# Altium schematic sheet ROOM_MICRO.SchDoc
size 297 x 209 mm
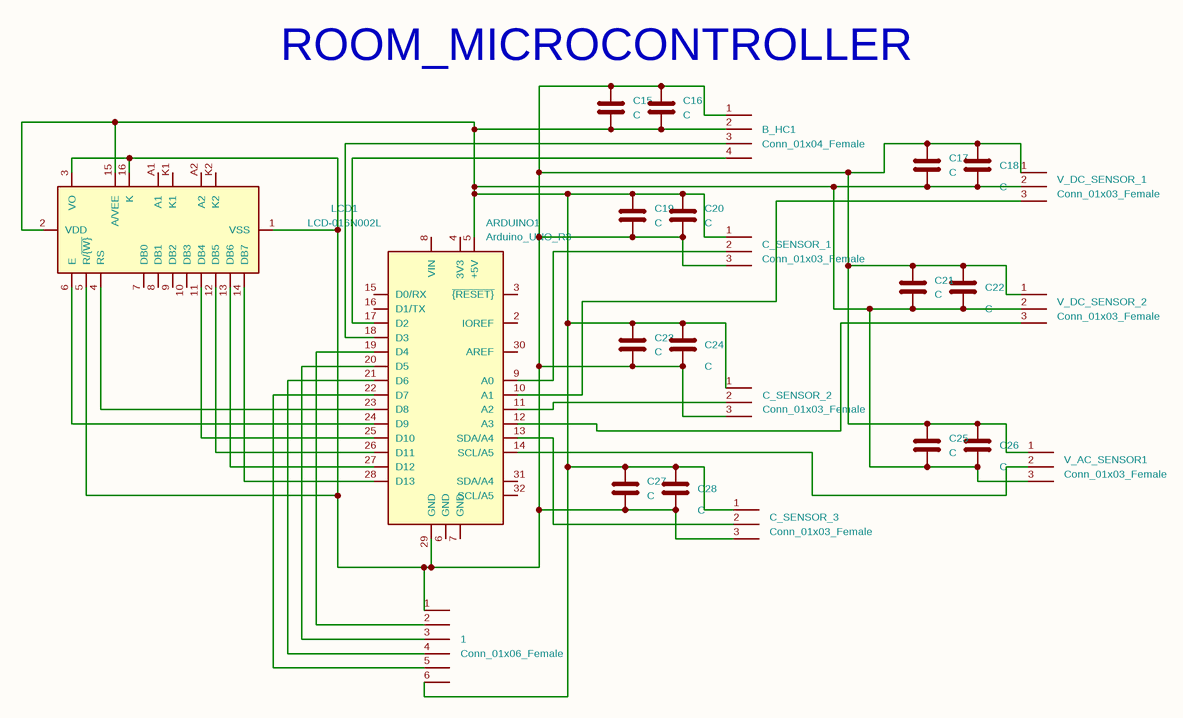
[diagram p0: ROOM_MICRO.SchDoc]

## Parts
1  Conn_01x06_Female  [PinHeader_1x06_P2.54mm_Vertical]
ARDUINO1  Arduino_UNO_R3  [Arduino_UNO_R3]
B_HC1  Conn_01x04_Female  [PinHeader_1x04_P2.54mm_Vertical]
C15  C  [C_0805_2012Metric]
C16  C  [C_0805_2012Metric]
C17  C  [C_0805_2012Metric]
C18  C  [C_0805_2012Metric]
C19  C  [C_0805_2012Metric]
C20  C  [C_0805_2012Metric]
C21  C  [C_0805_2012Metric]
C22  C  [C_0805_2012Metric]
C23  C  [C_0805_2012Metric]
C24  C  [C_0805_2012Metric]
C25  C  [C_0805_2012Metric]
C26  C  [C_0805_2012Metric]
C27  C  [C_0805_2012Metric]
C28  C  [C_0805_2012Metric]
C_SENSOR_1  Conn_01x03_Female  [PinHeader_1x03_P2.54mm_Vertical]
C_SENSOR_2  Conn_01x03_Female  [PinHeader_1x03_P2.54mm_Vertical]
C_SENSOR_3  Conn_01x03_Female  [PinHeader_1x03_P2.54mm_Vertical]
LCD1  LCD-016N002L  [LCD-016N002L]
V_AC_SENSOR1  Conn_01x03_Female  [PinHeader_1x03_P2.54mm_Vertical]
V_DC_SENSOR_1  Conn_01x03_Female  [PinHeader_1x03_P2.54mm_Vertical]
V_DC_SENSOR_2  Conn_01x03_Female  [PinHeader_1x03_P2.54mm_Vertical]

## Nets
Net1_1: 1.1(Pin_1) ARDUINO1.29(GND) B_HC1.1(Pin_1) C15.1 C16.1 C17.1 C18.1 C19.2 C20.2 C21.1 C22.1 C23.2 C24.2 C25.1 C26.1 C27.2 C28.2 C_SENSOR_1.3(Pin_3) C_SENSOR_2.3(Pin_3) C_SENSOR_3.3(Pin_3) LCD1.1(VSS) LCD1.3(VO) LCD1.5(R/~{{W}}) LCD1.16(K) V_AC_SENSOR1.1(Pin_1) V_DC_SENSOR_1.1(Pin_1) V_DC_SENSOR_2.1(Pin_1)
Net1_2: 1.2(Pin_2) ARDUINO1.19(D4)
Net1_3: 1.3(Pin_3) ARDUINO1.20(D5)
Net1_4: 1.4(Pin_4) ARDUINO1.21(D6)
Net1_5: 1.5(Pin_5) ARDUINO1.22(D7)
Net1_6: 1.6(Pin_6) ARDUINO1.5(+5V) B_HC1.2(Pin_2) C15.2 C16.2 C17.2 C18.2 C19.1 C20.1 C21.2 C22.2 C23.1 C24.1 C25.2 C26.2 C27.1 C28.1 C_SENSOR_1.1(Pin_1) C_SENSOR_2.1(Pin_1) C_SENSOR_3.1(Pin_1) LCD1.2(VDD) LCD1.15(A/VEE) V_AC_SENSOR1.3(Pin_3) V_DC_SENSOR_1.2(Pin_2) V_DC_SENSOR_2.2(Pin_2)
NetARDUINO1_9: ARDUINO1.9(A0) C_SENSOR_1.2(Pin_2)
NetARDUINO1_10: ARDUINO1.10(A1) V_DC_SENSOR_1.3(Pin_3)
NetARDUINO1_11: ARDUINO1.11(A2) C_SENSOR_2.2(Pin_2)
NetARDUINO1_12: ARDUINO1.12(A3) V_DC_SENSOR_2.3(Pin_3)
NetARDUINO1_13: ARDUINO1.13(SDA/A4) C_SENSOR_3.2(Pin_2)
NetARDUINO1_14: ARDUINO1.14(SCL/A5) V_AC_SENSOR1.2(Pin_2)
NetARDUINO1_17: ARDUINO1.17(D2) B_HC1.4(Pin_4)
NetARDUINO1_18: ARDUINO1.18(D3) B_HC1.3(Pin_3)
NetARDUINO1_23: ARDUINO1.23(D8) LCD1.4(RS)
NetARDUINO1_24: ARDUINO1.24(D9) LCD1.6(E)
NetARDUINO1_25: ARDUINO1.25(D10) LCD1.11(DB4)
NetARDUINO1_26: ARDUINO1.26(D11) LCD1.12(DB5)
NetARDUINO1_27: ARDUINO1.27(D12) LCD1.13(DB6)
NetARDUINO1_28: ARDUINO1.28(D13) LCD1.14(DB7)

Not connected (* = marked no-connect by the designer): ARDUINO1 1(NC) 2(IOREF) 3(~{{RESET}}) 4(3V3) 6(GND) 7(GND) 8(VIN) 15(D0/RX) 16(D1/TX) 30(AREF) 31(SDA/A4) 32(SCL/A5); LCD1 7(DB0) 8(DB1) 9(DB2) 10(DB3) A1 A2 K1 K2

## Notes on the sheet
- ROOM_MICROCONTROLLER
- 1
- 2
- 3
- 4
- 5
- 6
- A
- B
- C
- D
- Title:
- File: ROOM_MICRO.kicad_sch
- Sheet: /
- KiCad E.D.A.  kicad (5.1.4)-1
- Size: A4
- Date:
- Rev:
- Id: 1/1

## Library data of the parts
1 = Conn_01x06_Female: Value: Conn_01x06_Female; Footprint: Connector_PinHeader_2.54mm:PinHeader_1x06_P2.54mm_Vertical
ARDUINO1 = Arduino_UNO_R3: Value: Arduino_UNO_R3; Footprint: Module:Arduino_UNO_R3
B_HC1 = Conn_01x04_Female: Value: Conn_01x04_Female; Footprint: Connector_PinHeader_2.54mm:PinHeader_1x04_P2.54mm_Vertical
C15-C28 = C: Value: C; Footprint: Capacitor_SMD:C_0805_2012Metric
C_SENSOR_1-C_SENSOR_3 V_AC_SENSOR1 V_DC_SENSOR_1 V_DC_SENSOR_2 = Conn_01x03_Female: Value: Conn_01x03_Female; Footprint: Connector_PinHeader_2.54mm:PinHeader_1x03_P2.54mm_Vertical
LCD1 = LCD-016N002L: Value: LCD-016N002L; Footprint: Display:LCD-016N002L